# Altium schematic sheet SmartValve.SchDoc: SmartValve
size A3; Author: Shipovsky; Engineer: Shipovsky
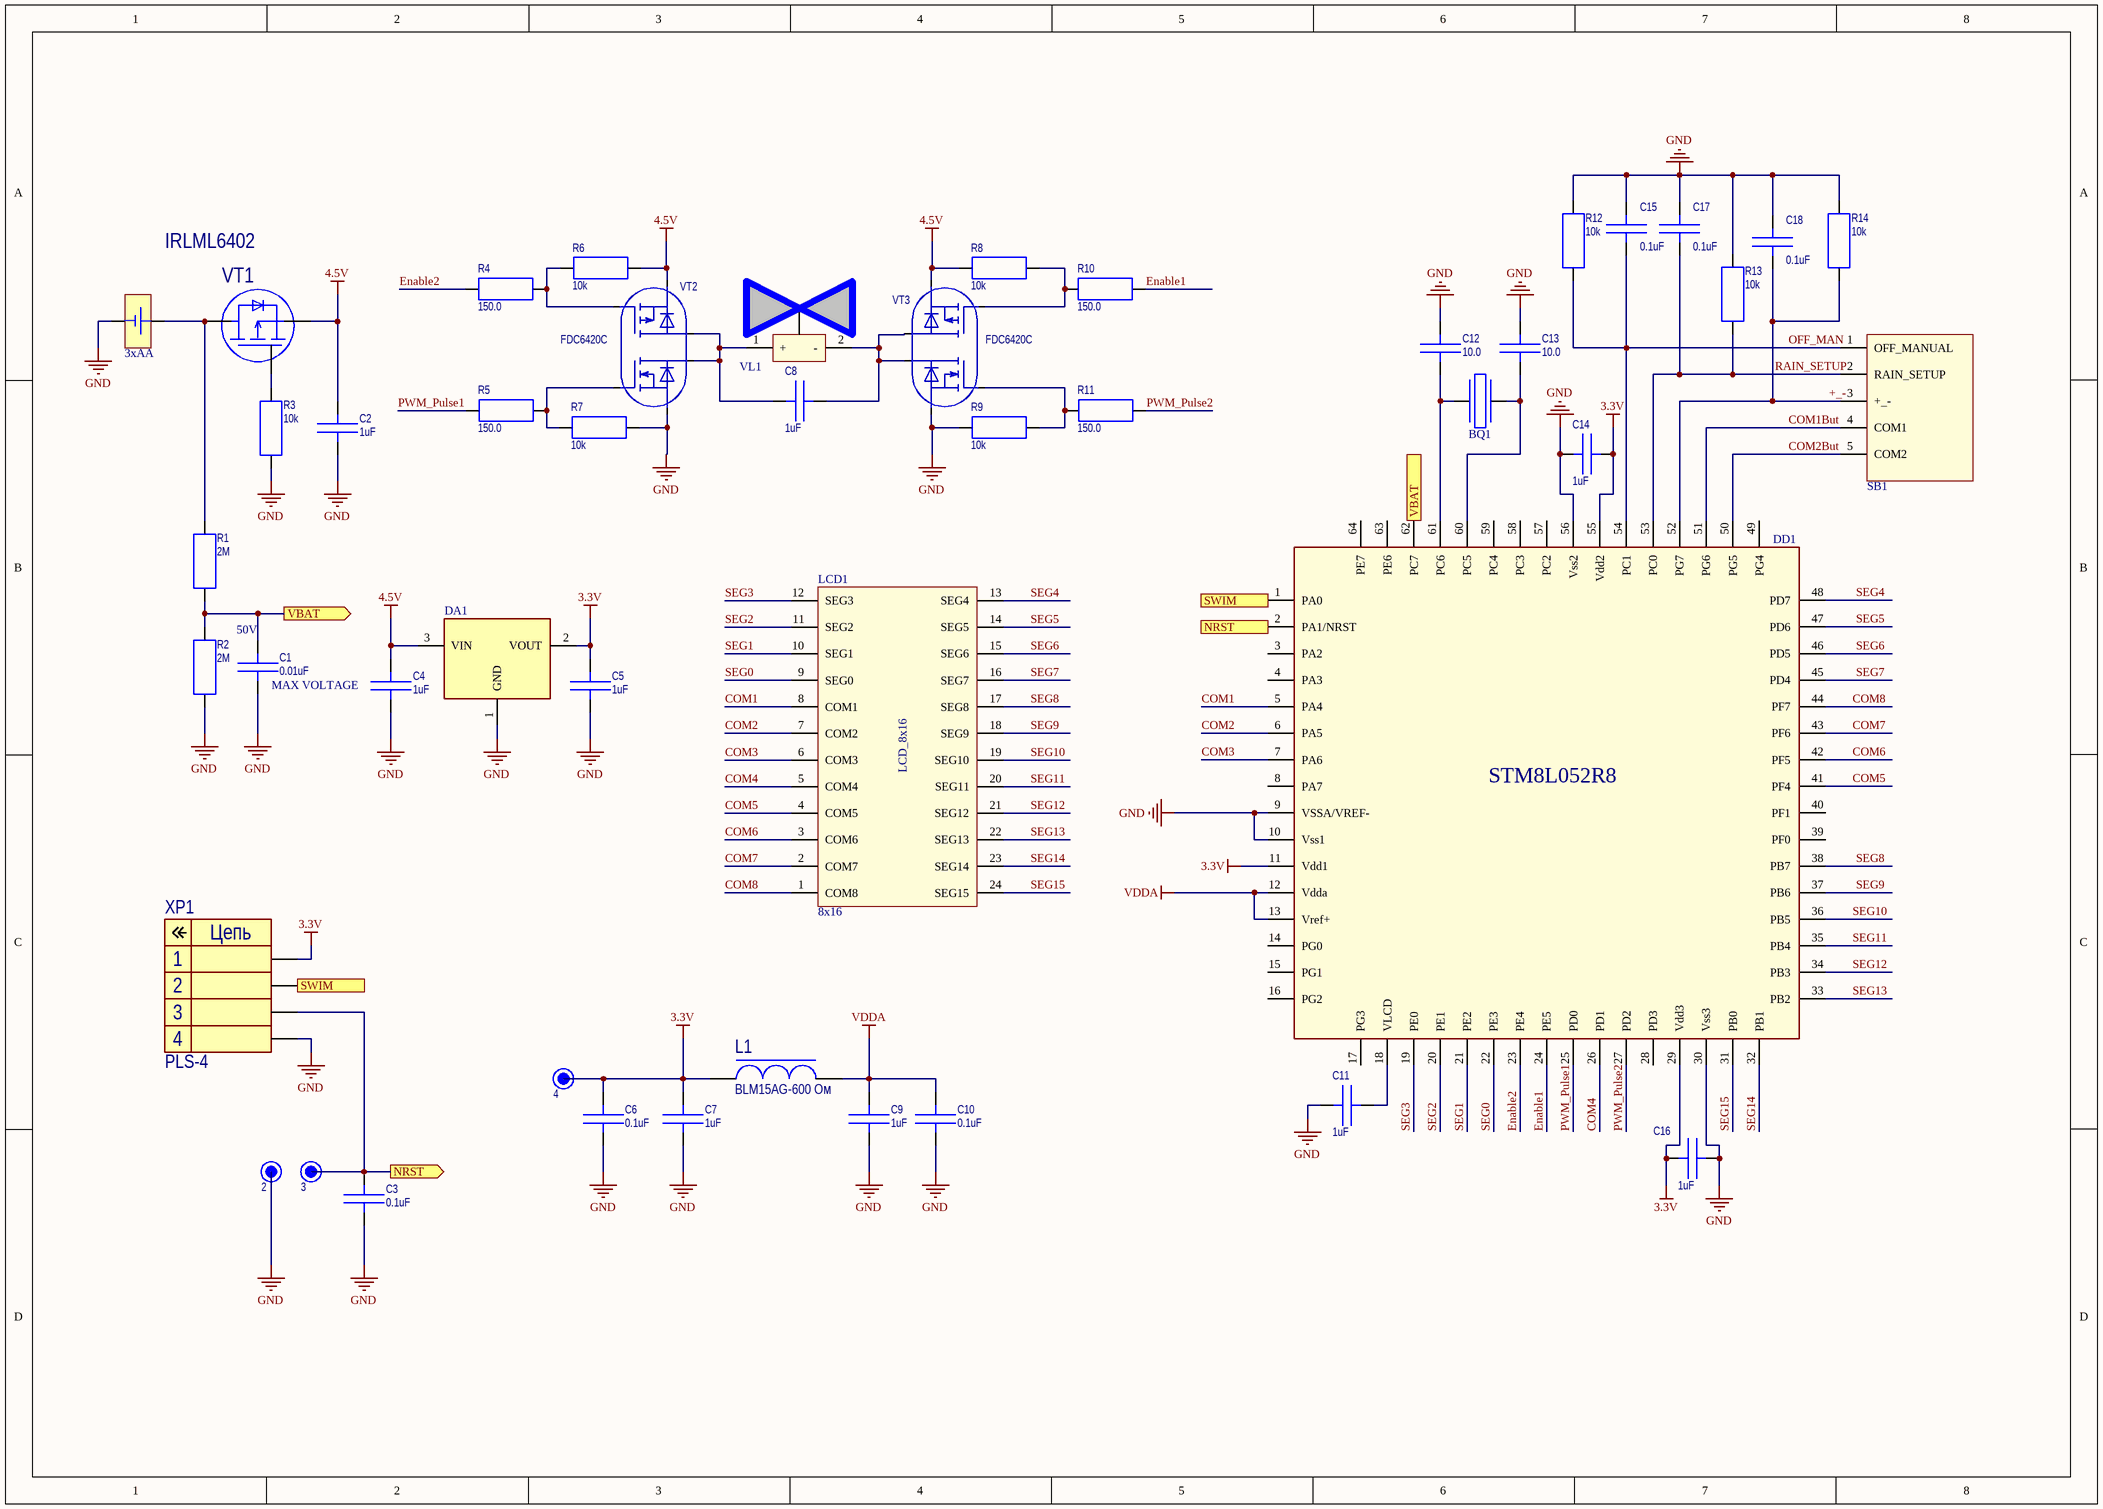
[diagram p0: SmartValve.SchDoc]

## Parts
1  3xAA  [BAT_3AA]
2  (no value)  [TP_36_PAD]  (no BOM)
3  (no value)  [TP_36_PAD]  (no BOM)
4  (no value)  [TP_36_PAD]  (no BOM)
BQ1  AB26T  [6.2 x 02.1MM CYLINDER PACKAGE]  (value not drawn)
C1  0.01uF  Voltage: 50V  [CC0402_0.5mm]
C2  1uF  [CC0402_0.5mm]
C3  0.1uF  [CC0402_0.5mm]
C4  1uF  [CC0402_0.5mm]
C5  1uF  [CC0402_0.5mm]
C6  0.1uF  [CC0402_0.5mm]
C7  1uF  [CC0402_0.5mm]
C8  1uF  [CC0402_0.5mm]
C9  1uF  [CC0402_0.5mm]
C10  0.1uF  [CC0402_0.5mm]
C11  1uF  [CC0402_0.5mm]
C12  10.0  [CC0402_0.5mm]
C13  10.0  [CC0402_0.5mm]
C14  1uF  [CC0402_0.5mm]
C15  0.1uF  [CC0402_0.5mm]
C16  1uF  [CC0402_0.5mm]
C17  0.1uF  [CC0402_0.5mm]
C18  0.1uF  [CC0402_0.5mm]
DA1  AP2138  [SOT-23]  (value not drawn)
DD1  STM8L052R8  [TQFP-64]
L1  BLM15AG-600 Ом  [CL0402(1005)]
LCD1  8x16  [LCD_8x16]
R1  2M  [RC0402]
R2  2M  [RC0402]
R3  10k  [RC0402]
R4  150.0  [RC0402]
R5  150.0  [RC0402]
R6  10k  [RC0402]
R7  10k  [RC0402]
R8  10k  [RC0402]
R9  10k  [RC0402]
R10  150.0  [RC0402]
R11  150.0  [RC0402]
R12  10k  [RC0402]
R13  10k  [RC0402]
R14  10k  [RC0402]
SB1  SB?  [Membrane keyboard]  (value not drawn)
VL1  Electric valve  [Electric valve]  (value not drawn)
VT1  IRLML6402  [SOT-23]
VT2  FDC6420C  [SuperSOT-6]
VT3  FDC6420C  [SuperSOT-6]
XP1  PLS-4  [PLS-4]

## Ports
NRST (in), NRST (out), SWIM (out), VBAT (in), VBAT (out)

## Nets
3.3V: 4.1 C5.1 C6.1 C7.1 C14.2 C16.2 DA1.2(VOUT) DD1.11(Vdd1) DD1.29(Vdd3) DD1.55(Vdd2) L1.1 XP1.1
4.5V: C2.1 C4.1 DA1.3(VIN) R6.2 R8.1 VT1.2(SORCH) VT2.2(Sp) VT3.2(Sp)
GND: 1.2(-) 2.1 C1.2 C2.2 C3.2 C4.2 C5.2 C6.2 C7.2 C9.2 C10.2 C11.2 C12.1 C13.1 C14.1 C15.1 C16.1 C17.1 C18.1 DA1.1(GND) DD1.9(VSSA/VREF-) DD1.10(Vss1) DD1.30(Vss3) DD1.56(Vss2) R2.2 R3.2 R7.2 R9.1 R12.2 R13.2 R14.2 VT2.5(Sn) VT3.5(Sn) XP1.4
VDDA: C9.1 C10.1 DD1.12(Vdda) DD1.13(Vref+) L1.2
+_-: C18.2 DD1.52(PG7) R14.1 SB1.3(+_-)
COM1: DD1.5(PA4) LCD1.8(COM1)
COM1But: DD1.51(PG6) SB1.4(COM1)
COM2: DD1.6(PA5) LCD1.7(COM2)
COM2But: DD1.50(PG5) SB1.5(COM2)
COM3: DD1.7(PA6) LCD1.6(COM3)
COM4: DD1.26(PD1) LCD1.5(COM4)
COM5: DD1.41(PF4) LCD1.4(COM5)
COM6: DD1.42(PF5) LCD1.3(COM6)
COM7: DD1.43(PF6) LCD1.2(COM7)
COM8: DD1.44(PF7) LCD1.1(COM8)
Enable1: DD1.24(PE5) R10.2
Enable2: DD1.23(PE4) R4.1
NRST: 3.1 C3.1 DD1.2(PA1/NRST) XP1.3 ; port NRST
OFF_MAN: C15.2 DD1.54(PC1) R12.1 SB1.1(OFF_MANUAL)
PWM_Pulse1: DD1.25(PD0) R5.1
PWM_Pulse2: DD1.27(PD2) R11.2
RAIN_SETUP: C17.2 DD1.53(PC0) R13.1 SB1.2(RAIN_SETUP)
SEG0: DD1.22(PE3) LCD1.9(SEG0)
SEG1: DD1.21(PE2) LCD1.10(SEG1)
SEG2: DD1.20(PE1) LCD1.11(SEG2)
SEG3: DD1.19(PE0) LCD1.12(SEG3)
SEG4: DD1.48(PD7) LCD1.13(SEG4)
SEG5: DD1.47(PD6) LCD1.14(SEG5)
SEG6: DD1.46(PD5) LCD1.15(SEG6)
SEG7: DD1.45(PD4) LCD1.16(SEG7)
SEG8: DD1.38(PB7) LCD1.17(SEG8)
SEG9: DD1.37(PB6) LCD1.18(SEG9)
SEG10: DD1.36(PB5) LCD1.19(SEG10)
SEG11: DD1.35(PB4) LCD1.20(SEG11)
SEG12: DD1.34(PB3) LCD1.21(SEG12)
SEG13: DD1.33(PB2) LCD1.22(SEG13)
SEG14: DD1.32(PB1) LCD1.23(SEG14)
SEG15: DD1.31(PB0) LCD1.24(SEG15)
SWIM: DD1.1(PA0) XP1.2 ; port SWIM
VBAT: C1.1 DD1.62(PC7) R1.2 R2.1 ; port VBAT
Net1_1: 1.1(+) R1.1 VT1.3(DRAIN)
NetBQ1_1: BQ1.1 C12.2 DD1.61(PC6)
NetBQ1_2: BQ1.2 C13.2 DD1.60(PC5)
NetC8_1: C8.1 VL1.1(+) VT2.4(Dp) VT2.6(Dn)
NetC8_2: C8.2 VL1.2(-) VT3.4(Dp) VT3.6(Dn)
NetC11_1: C11.1 DD1.18(VLCD)
NetR3_1: R3.1 VT1.1(GATE)
NetR4_2: R4.2 R6.1 VT2.3(Gp)
NetR5_2: R5.2 R7.1 VT2.1(Gn)
NetR8_2: R8.2 R10.1 VT3.3(Gp)
NetR9_2: R9.2 R11.1 VT3.1(Gn)

Not connected (* = marked no-connect by the designer): DD1 3(PA2) 4(PA3) 8(PA7) 14(PG0) 15(PG1) 16(PG2) 17(PG3) 28(PD3) 39(PF0) 40(PF1) 49(PG4) 57(PC2) 58(PC3) 59(PC4) 63(PE6) 64(PE7)

## Notes on the sheet
- (near C1) MAX VOLTAGE
- Title
- Size:
- Date:
- A3
- Number:
- Time:
- Revision:
- Sheet
- of
- File:
- (in symbol PLS-4) Цепь

## Library data of the parts
2-4 = TP_36_PAD: Тестпоинт монтажа; ComponentVersion: 0; Type: Testpoint; Part Number: TP_36_PAD; Name: TP_36_PAD; Creator: Турнаев С.С.; ComponentHeight: 0.0; PatternVersion: 0
C1 = C0402_X7R_0.1uF_10%_16V: Конденсатор SMD CC 0402-X7R-0,1uF-10%-16V CC0402KRX7R7BB104 YAGEO (CL05B104KO5NNNC SAMSUNG, GRM155R71C104KA57D MURATA); Part Number: C0402_X7R_0.01uF_10%_50V; Developer_ID: 333447376; DeveloperRecomend: Желательно; ComponentVersion: 0; PatternVersion: 1; TempRange: -55..+125°C; Type: X7R; Tolerance: 10%; Name: C0402_X7R_0.01uF_10%_50V; DeveloperMnemocod: C0402_X7R_0.01uF_10%_50V; Manufacturer: Yageo; Creator: Турнаев С.С.; ComponentHeight: 0.5mm; ComponentLink1Description: Manufacturer; ComponentLink1URL: http://www.yageo.com/; ComponentLink2Description: Datasheet; ComponentLink2URL: \\192.168.11.60\BolidLibrary\Altium\Database\Datasheets\727234197.pdf; ComponentLink3Description: Datasheet 2; ComponentLink4Description: Datasheet 3; Value: 0.01uF
C2 C4 C5 C7-C9 C11 C14 C16 = C0402_X5R_1uF_10%_10V: Конденсатор SMD CC 0402-X5R-1uF-10%-10V CL05A105KP5NNNC SAMSUNG; Manufacturer: Yageo; Developer_ID: 539117446; ComponentVersion: 0; PatternVersion: 1; TempRange: -55..+85°C; Type: X5R; Voltage: 10V; Tolerance: 10%; Part Number: C0402_X5R_1uF_10%_10V; Name: C0402_X5R_1uF_10%_10V; DeveloperMnemocod: C0402_X5R_1uF_10%_10V; Creator: Турнаев С.С.; ComponentHeight: 0.5mm; ComponentLink1Description: Manufacturer; ComponentLink1URL: http://www.yageo.com/; ComponentLink2Description: Datasheet; ComponentLink3Description: Datasheet 2; ComponentLink4Description: Datasheet 3; Value: 1uF
C3 C6 C10 C15 C17 C18 = C0402_X7R_0.1uF_10%_16V: Конденсатор SMD CC 0402-X7R-0,1uF-10%-16V CC0402KRX7R7BB104 YAGEO (CL05B104KO5NNNC SAMSUNG, GRM155R71C104KA57D MURATA); Developer_ID: 333447376; DeveloperRecomend: Желательно; ComponentVersion: 0; PatternVersion: 1; TempRange: -55..+125°C; Type: X7R; Voltage: 16V; Tolerance: 10%; Part Number: C0402_X7R_0.1uF_10%_16V; Name: C0402_X7R_0.1uF_10%_16V; DeveloperMnemocod: C0402_X7R_0.1uF_10%_16V; Manufacturer: Yageo; Creator: Турнаев С.С.; ComponentHeight: 0.5mm; ComponentLink1Description: Manufacturer; ComponentLink1URL: http://www.yageo.com/; ComponentLink2Description: Datasheet; ComponentLink2URL: \\192.168.11.60\BolidLibrary\Altium\Database\Datasheets\727234197.pdf; ComponentLink3Description: Datasheet 2; ComponentLink4Description: Datasheet 3; Value: 0.1uF
C12 C13 = C0402_NP0_10pF_5%_16V: CC0402 General purpose MLCC; Manufacturer: Yageo; ComponentVersion: 0; PatternVersion: 1; TempRange: -55..+125°C; Type: NP0; Voltage: 16V; Tolerance: ±5%; Part Number: C0402_NP0_10pF_5%_16V; Name: C0402_NP0_10pF_5%_16V; Creator: Турнаев С.С.; ComponentHeight: 0.5mm; ComponentLink1Description: Manufacturer; ComponentLink1URL: http://www.yageo.com/; ComponentLink2Description: Datasheet; ComponentLink3Description: Datasheet 2; ComponentLink4Description: Datasheet 3; Value: 10.0
DA1 = AP2138: Low quiescent current; Supplier 1: Farnell; Supplier Part Number 1: 3257434
DD1 = STM8L052R8: 8-bit микроконтроллер Low power
L1 = BLM15: Чип индуктивность подавления EMP; VALUE: 600 Ом; Компэл: BLM15AG601SN1D; Supplier 1: Farnell; Supplier Part Number 1: 1515762
LCD1 = LCD_8x16
R1 R2 = 0402-2M-1%: Series RC0402; Manufacturer: Yageo; ComponentVersion: 0; PatternVersion: 1; TempRange: -55..+155°C; Tolerance: ±1%; TemperatureCoef: ±100 ppm/°C; MaxWorkingVoltage: 50V; PowerDiss: 0.0625 W; Part Number: 0402-2M-1%; Name: 0402-2M-1%; Creator: Турнаев С.С.; ComponentHeight: 0.35mm; ComponentLink1Description: Manufacturer; ComponentLink1URL: http://www.yageo.com/; ComponentLink2Description: Datasheet; ComponentLink3Description: Datasheet 2; ComponentLink4Description: Datasheet 3; Value: 2M; Type: General purpose
R3 R6-R9 R12-R14 = 0402-10K-5%: Резистор SMD CR 0402-10K-5%-0.063W; Manufacturer: Yageo; Developer_ID: 155833251; DeveloperRecomend: Желательно; AnalogDB: 0402-10K-1%; ComponentVersion: 0; PatternVersion: 1; TempRange: -55..+155°C; Tolerance: ±5%; TemperatureCoef: ±100 ppm/°C; MaxWorkingVoltage: 50V; PowerDiss: 0.0625 W; Part Number: 0402-10K-5%; Name: 0402-10K-5%; DeveloperMnemocod: 0402-10K-5%; Creator: Турнаев С.С.; ComponentHeight: 0.35mm; ComponentLink1Description: Manufacturer; ComponentLink1URL: http://www.yageo.com/; ComponentLink2Description: Datasheet; ComponentLink2URL: \\192.168.11.60\BolidLibrary\Altium\Database\Datasheets\845136600.pdf; ComponentLink3Description: Datasheet 2; ComponentLink4Description: Datasheet 3; Value: 10k
R4 R5 R10 R11 = 0402-150R-5%: Резистор SMD CR 0402-150R-5%-0.063W; Manufacturer: Yageo; Developer_ID: 489132610; DeveloperRecomend: Желательно; AnalogDB: 0402-150R-1%; ComponentVersion: 0; PatternVersion: 1; TempRange: -55..+155°C; Tolerance: ±5%; TemperatureCoef: ±100 ppm/°C; MaxWorkingVoltage: 50V; PowerDiss: 0.0625 W; Part Number: 0402-150R-5%; Name: 0402-150R-5%; DeveloperMnemocod: 0402-150R-5%; Creator: Турнаев С.С.; ComponentHeight: 0.35mm; ComponentLink1Description: Manufacturer; ComponentLink1URL: http://www.yageo.com/; ComponentLink2Description: Datasheet; ComponentLink2URL: \\192.168.11.60\BolidLibrary\Altium\Database\Datasheets\845136600.pdf; ComponentLink3Description: Datasheet 2; ComponentLink4Description: Datasheet 3; Value: 150.0
SB1 = Membrane keyboard
VT1 = IRLML6402: p - канал; Supplier 1: Digi-Key; Supplier Part Number 1: IRLML6402GTRPBFDKR-ND
VT2 VT3 = FDC6420C: Транзистор FDC6420C; Manufacturer: Fairchild; Developer_ID: 548145014; ComponentVersion: 0; Part Number: FDC6420C; Name: FDC6420C; DeveloperMnemocod: FDC6420C; Creator: Турнаев С.С.; PatternVersion: 0; ComponentLink1Description: Manufacturer; ComponentLink1URL: http://www.fairchildsemi.com; ComponentLink2Description: Datasheet; ComponentLink3Description: Datasheet 2; ComponentLink4Description: Datasheet 3
XP1 = PLS-4: Штыри на плату однорядные
BQ1 = AB26T: Supplier 1: Farnell; Supplier Part Number 1: 1861653